# EAGLE schematic s-tuner_demo_board (EAGLE 6.1)
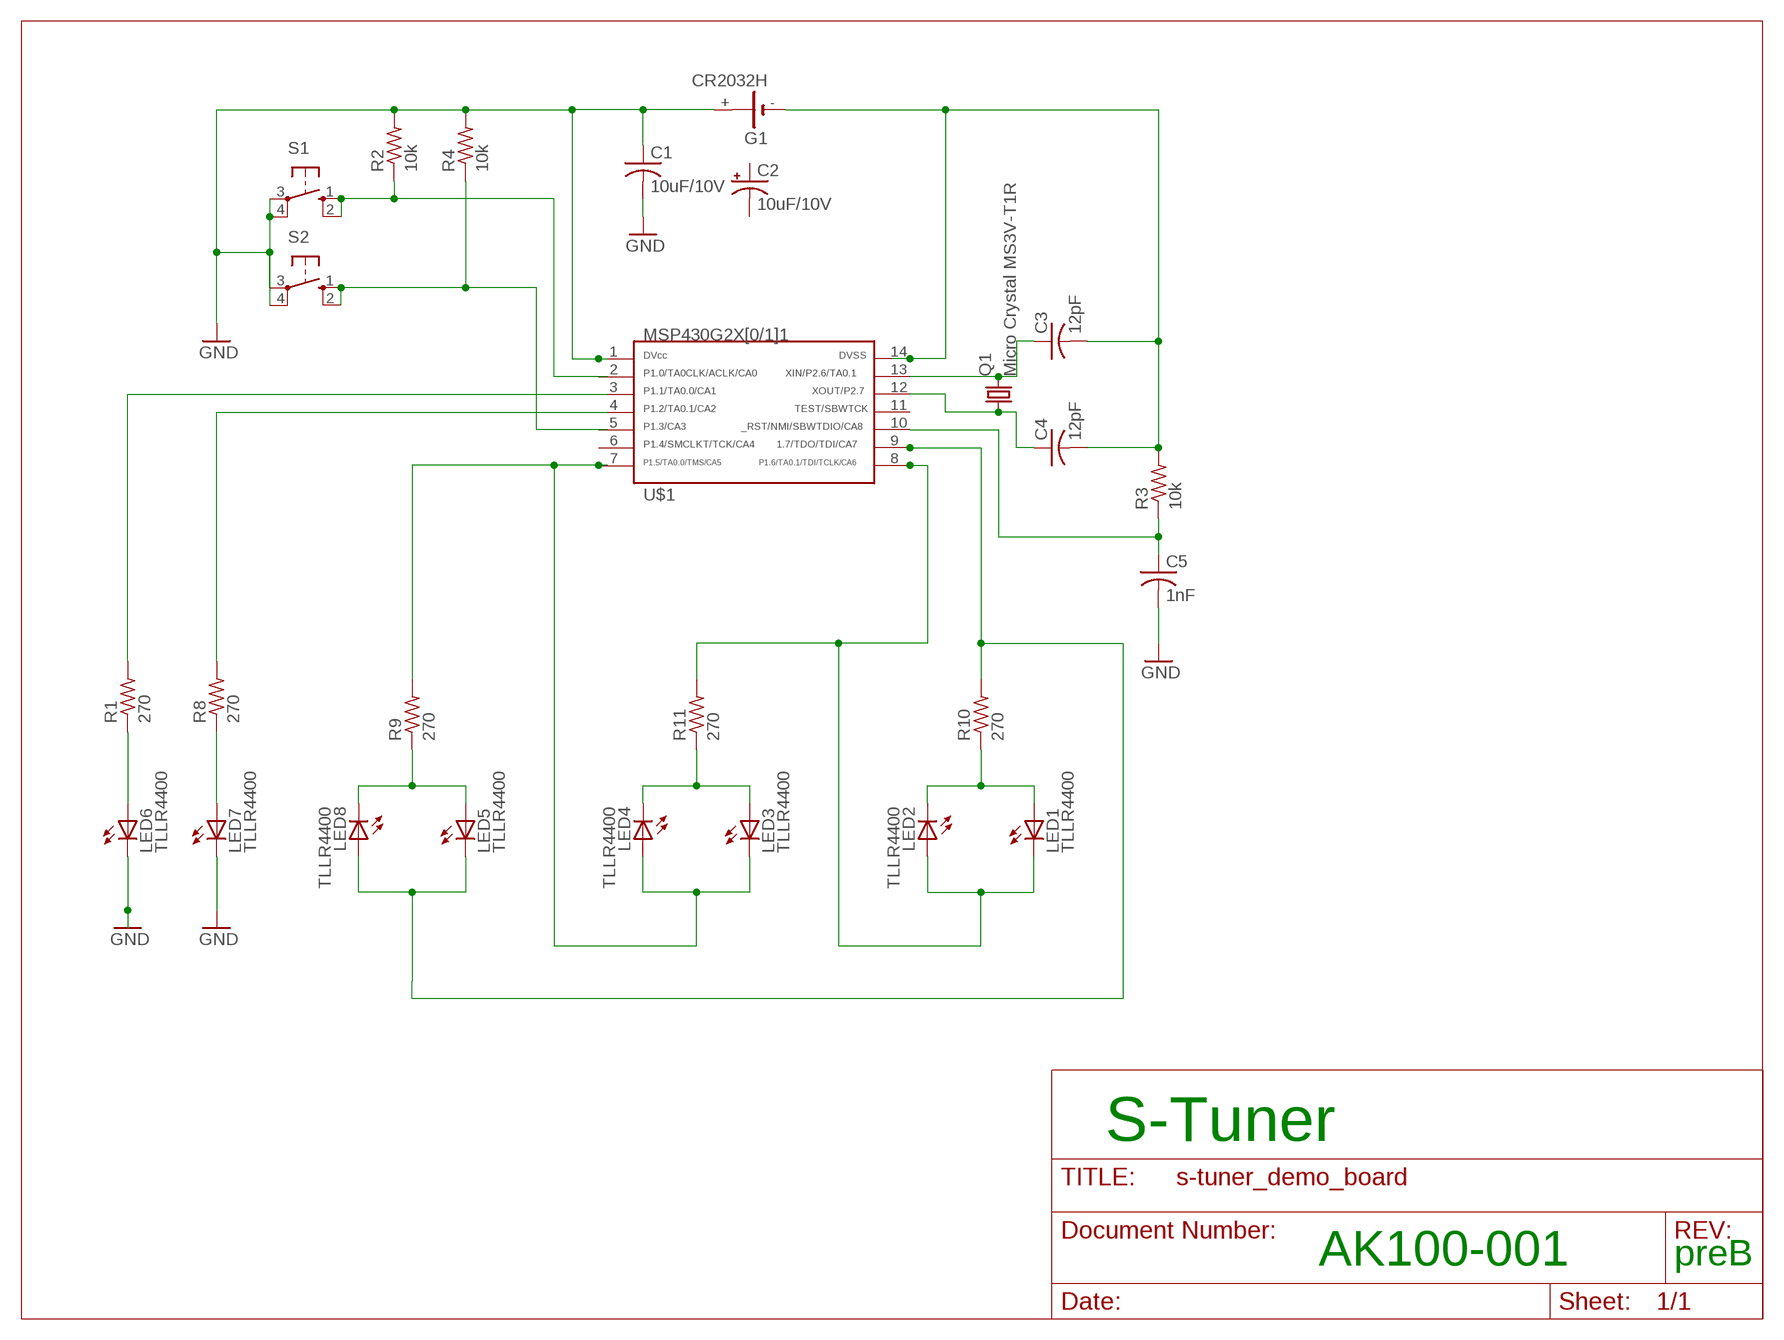
[diagram p0: schematic, sheet 1]

## Parts
C1  10uF/10V  C-USC0805  [C0805]
C2  10uF/10V  CPOL-USSMCB  [SMC_B]
C3  12pF  C-USC0805  [C0805]
C4  12pF  C-USC0805  [C0805]
C5  1nF  C-USC0805  [C0805]
G1  CR2032H  [CR2032H]
LED1  TLLR4400  [LED3MM]
LED2  TLLR4400  [LED3MM]
LED3  TLLR4400  [LED3MM]
LED4  TLLR4400  [LED3MM]
LED5  TLLR4400  [LED3MM]
LED6  TLLR4400  [LED3MM]
LED7  TLLR4400  [LED3MM]
LED8  TLLR4400  [LED3MM]
Q1  Micro Crystal MS3V-T1R  CRYSTALTC26H  [TC26H]
R1  270  R-US_R0805  [R0805]
R2  10k  R-US_R0805  [R0805]
R3  10k  R-US_R0805  [R0805]
R4  10k  R-US_R0805  [R0805]
R8  270  R-US_R0805  [R0805]
R9  270  R-US_R0805  [R0805]
R10  270  R-US_R0805  [R0805]
R11  270  R-US_R0805  [R0805]
S1  10-XX  [B3F-10XX]
S2  10-XX  [B3F-10XX]
U$1  G2X[0/1]1---N14  [N14]

## Nets
GND: C1.1 C1.2 C5.2 G1.+ LED6.K(C) LED7.K(C) R2.2 R4.2 S1.3(P) S1.4(P1) S2.3(P) S2.4(P1) U$1.1
N$1: C5.1 R3.1 U$1.10
N$3: C3.2 C4.2 G1.- R3.2 U$1.14
N$4: LED1.K(C) LED2.A R11.2 U$1.8
N$5: LED3.A LED4.K(C) R11.1
N$6: LED5.K(C) LED8.A R10.2 U$1.9
N$7: C4.1 Q1.1 U$1.12
N$8: LED5.A LED8.K(C) R9.1
N$9: LED3.K(C) LED4.A R9.2 U$1.7
N$10: R8.2
N$11: LED1.A LED2.K(C) R10.1
N$12: LED7.A R8.1
N$13: R1.2
N$14: R2.1 S1.1(S) S1.2(S1)
N$15: R4.1 S2.1(S) S2.2(S1)
N$16: C3.1 Q1.2 U$1.13
N$19: LED6.A R1.1
Unconnected: C2.+ C2.- G1.+@1(+) U$1.2 U$1.3 U$1.4 U$1.5 U$1.6 U$1.11

## Notes on the sheet
- S-Tuner
- AK100-001 | preB

## Library data of the parts
C1 = rcl:C-US: CAPACITOR, American symbol
C2 = rcl:CPOL-US: POLARIZED CAPACITOR, American symbol
C3-C5 = resistor:C-US: CAPACITOR, American symbol
G1 = battery:CR2032H: LI BATTERY Varta
LED1-LED8 = led:TLLR4400: Low Current (2mA) LED 3 mm Tinted Diffused Package color RED Source: Data sheet <http://www.farnell.com/datasheets/391100.pdf>; MF: VISHAY SEMICONDUCTOR; OC_FARNELL: 1612437
Q1 = crystal:CRYSTAL: CRYSTAL; OC_FARNELL: unknown; OC_NEWARK: unknown
R1-R4 R8-R11 = rcl:R-US_: RESISTOR, American symbol
S1 S2 = switch-omron:10-XX: OMRON SWITCH; MPN: B3F-1000; OC_FARNELL: 176432; OC_NEWARK: 36M3542
U$1 = TI_MSP430_v16:G2X[0/1]1---N14: MSP430G2X[0/1]1 MSP430G2001, MSP430G2101, MSP430G2201,MSP430G2111, G2211 PDIP (N) 14 Pin Package http://focus.ti.com/docs/prod/folders/print/msp430g2111.html